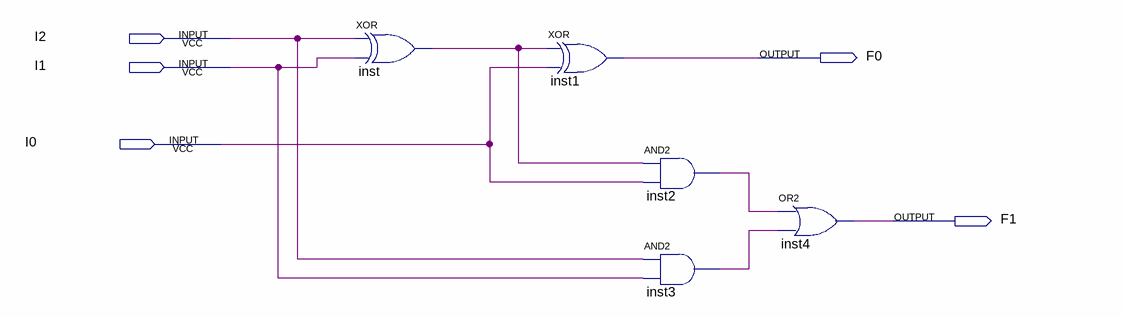
[diagram p0: schematic sheet]
// Quartus schematic FULLADDER.bdf as structural Verilog: 5 symbols, 5 pins
module FULLADDER (
  input  I2,
  input  I1,
  input  I0,
  output F0,
  output F1
);

  wire inst2_out, inst3_out, inst_out;

  xor inst (inst_out, I2, I1);
  xor inst1 (F0, inst_out, I0);
  and inst2 (inst2_out, inst_out, I0);
  and inst3 (inst3_out, I2, I1);
  or inst4 (F1, inst2_out, inst3_out);
endmodule
